# Altium schematic sheet lpc11c14.SchDoc
size A4; Organization: UNSW Solar Racing Team; Address3: UNSW; Address4: Sydney NSW 2052; Address2: Electrical Engineering; Address1: Rm 109
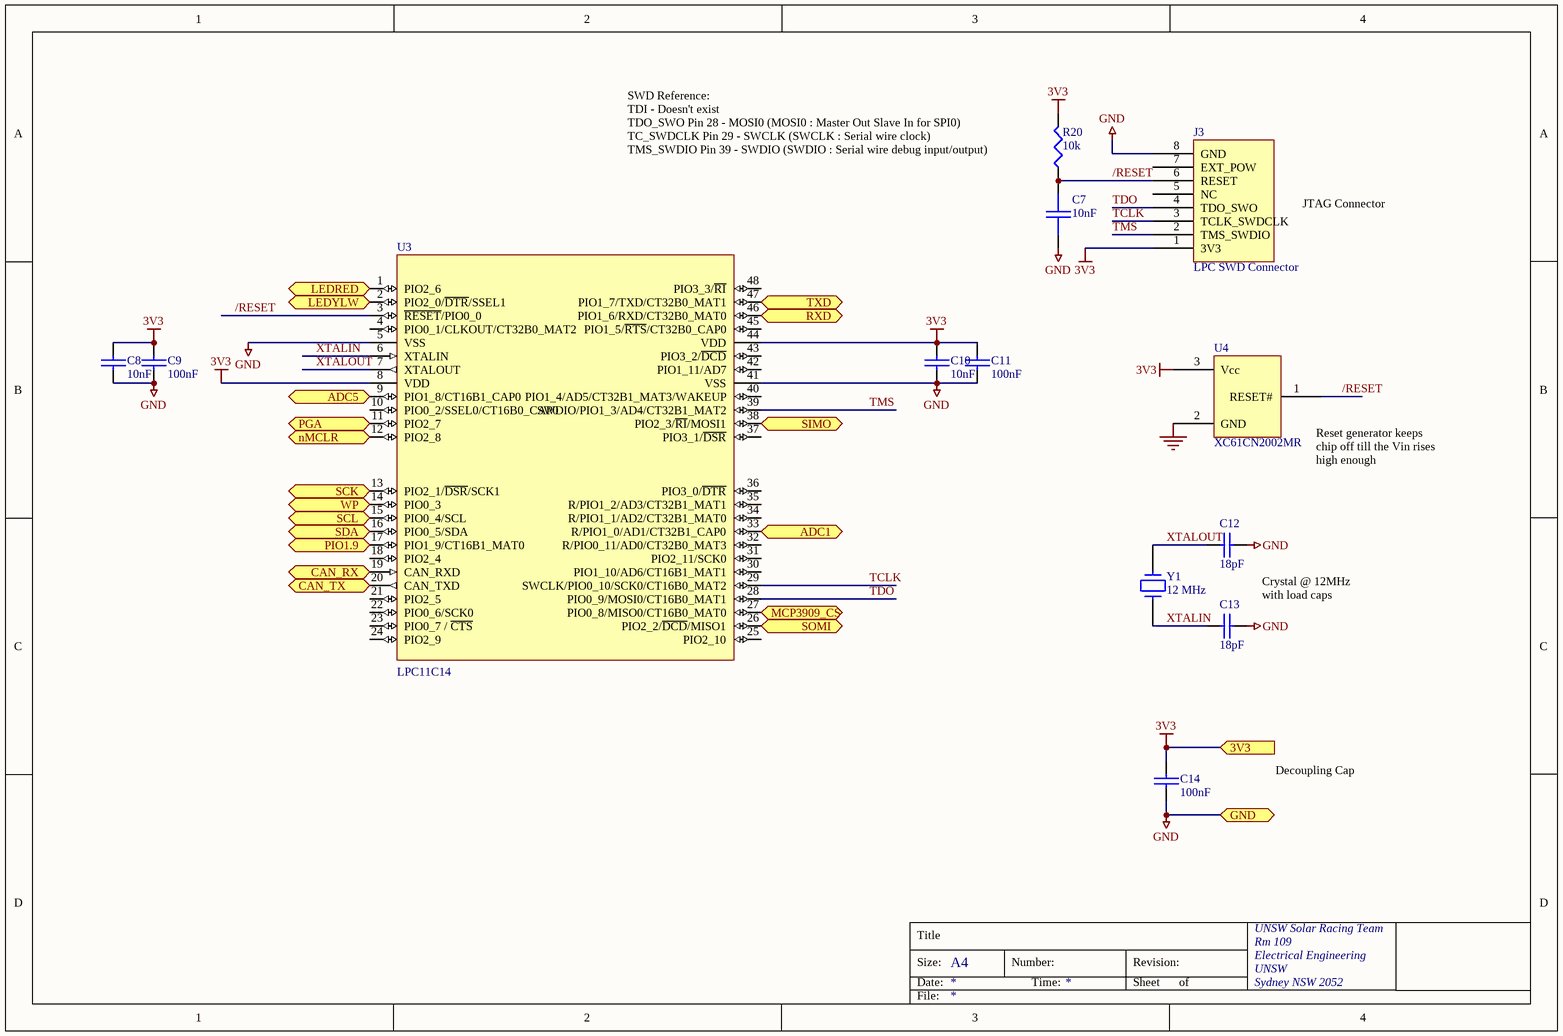
[diagram p0: lpc11c14.SchDoc]

## Parts
C7  10nF  [0603]
C8  10nF  [0603]
C9  100nF  [0603]
C10  10nF  [0603]
C11  100nF  [0603]
C12  18pF  [0603]
C13  18pF  [0603]
C14  100nF  [0603]
J3  LPC SWD Connector  [IDC8]
R20  10k  [0603]
U3  LPC11C14  [Quad48-LPC11c14]
U4  XC61CN2002MR  [SOT23-3]
Y1  12 MHz  [HC49/4H]

## Ports
3V3, ADC1 (in), ADC5 (in), CAN_RX (in), CAN_TX (out), GND, LEDRED (bidir), LEDYLW (bidir), MCP3909_CS, nMCLR, PGA, PIO1.9 (bidir), RXD (bidir), SCK (bidir), SCL (bidir), SDA (bidir), SIMO (bidir), SOMI (bidir), TXD (bidir), WP (bidir)

## Nets
3V3: C8.2 C9.2 C10.2 C11.2 C14.1 J3.1(3V3) R20.2 U3.8(VDD) U3.44(VDD) U4.3(Vcc) ; port 3V3
GND: C7.2 C8.1 C9.1 C10.1 C11.1 C12.2 C13.2 C14.2 J3.8(GND) U3.5(VSS) U3.41(VSS) U4.2(GND) ; port GND
/RESET: C7.1 J3.6(RESET) R20.1 U3.3(~{RESET}/PIO0_0) U4.1(RESET#)
ADC1: U3.33(R/PIO1_0/AD1/CT32B1_CAP0) ; port ADC1
ADC5: U3.9(PIO1_8/CT16B1_CAP0) ; port ADC5
CAN_RX: U3.19(CAN_RXD) ; port CAN_RX
CAN_TX: U3.20(CAN_TXD) ; port CAN_TX
LEDRED: U3.1(PIO2_6) ; port LEDRED
LEDYLW: U3.2(PIO2_0/~{DTR}/SSEL1) ; port LEDYLW
MCP3909_CS: U3.27(PIO0_8/MISO0/CT16B0_MAT0) ; port MCP3909_CS
nMCLR: U3.12(PIO2_8) ; port nMCLR
PGA: U3.11(PIO2_7) ; port PGA
PIO1.9: U3.17(PIO1_9/CT16B1_MAT0) ; port PIO1.9
RXD: U3.46(PIO1_6/RXD/CT32B0_MAT0) ; port RXD
SCK: U3.13(PIO2_1/~{DSR}/SCK1) ; port SCK
SCL: U3.15(PIO0_4/SCL) ; port SCL
SDA: U3.16(PIO0_5/SDA) ; port SDA
SIMO: U3.38(PIO2_3/~{RI}/MOSI1) ; port SIMO
SOMI: U3.26(PIO2_2/~{DCD}/MISO1) ; port SOMI
TCLK: J3.3(TCLK_SWDCLK) U3.29(SWCLK/PIO0_10/SCK0/CT16B0_MAT2)
TDO: J3.4(TDO_SWO) U3.28(PIO0_9/MOSI0/CT16B0_MAT1)
TMS: J3.2(TMS_SWDIO) U3.39(SWDIO/PIO1_3/AD4/CT32B1_MAT2)
TXD: U3.47(PIO1_7/TXD/CT32B0_MAT1) ; port TXD
WP: U3.14(PIO0_3) ; port WP
XTALIN: C13.1 U3.6(XTALIN) Y1.1
XTALOUT: C12.1 U3.7(XTALOUT) Y1.2

Not connected (* = marked no-connect by the designer): J3 5(NC) 7(EXT_POW); U3 4(PIO0_1/CLKOUT/CT32B0_MAT2) 10(PIO0_2/SSEL0/CT16B0_CAP0) 18(PIO2_4) 21(PIO2_5) 22(PIO0_6/SCK0) 23(PIO0_7_/_~{CTS}) 24(PIO2_9) 25(PIO2_10) 30(PIO1_10/AD6/CT16B1_MAT1) 31(PIO2_11/SCK0) 32(R/PIO0_11/AD0/CT32B0_MAT3) 34(R/PIO1_1/AD2/CT32B1_MAT0) 35(R/PIO1_2/AD3/CT32B1_MAT1) 36(PIO3_0/~{DTR}) 37(PIO3_1/~{DSR}) 40(PIO1_4/AD5/CT32B1_MAT3/WAKEUP) 42(PIO1_11/AD7) 43(PIO3_2/~{DCD}) 45(PIO1_5/~{RTS}/CT32B0_CAP0) 48(PIO3_3/~{RI})

## Notes on the sheet
- SWD Reference:
  TDI - Doesn't exist
  TDO_SWO Pin 28 - MOSI0 (MOSI0 : Master Out Slave In for SPI0)
  TC_SWDCLK Pin 29 - SWCLK (SWCLK : Serial wire clock)
  TMS_SWDIO Pin 39 - SWDIO (SWDIO : Serial wire debug input/output)
- JTAG Connector
- (near U4) Reset generator keeps chip off till the Vin rises high enough
- Crystal @ 12MHz with load caps
- Decoupling Cap
- Title
- Size:
- Date:
- A4
- Number:
- Time:
- Revision:
- Sheet
- of
- File:

## Library data of the parts
C7-C14 = CAP: Capacitor
  C7: Farnell: 722-236; Price: 0.15
  C8-C11 C14: Farnell: 753-567; Price: 0.31
  C12 C13: Farnell: 721-992; Price: 0.11
J3 = LPCLink_Connector: Farnell: 511-808; Price: 1.32
R20 = RES1: Resistor; Farnell: 612-601; Price: 0.11
U3 = LPC11C14_Full: Farnell: NA
U4 = XC61F: SOT23 reset generator; Farnell: NA
Y1 = CRYSTAL: Farnell: 485-111; Price: 3.38